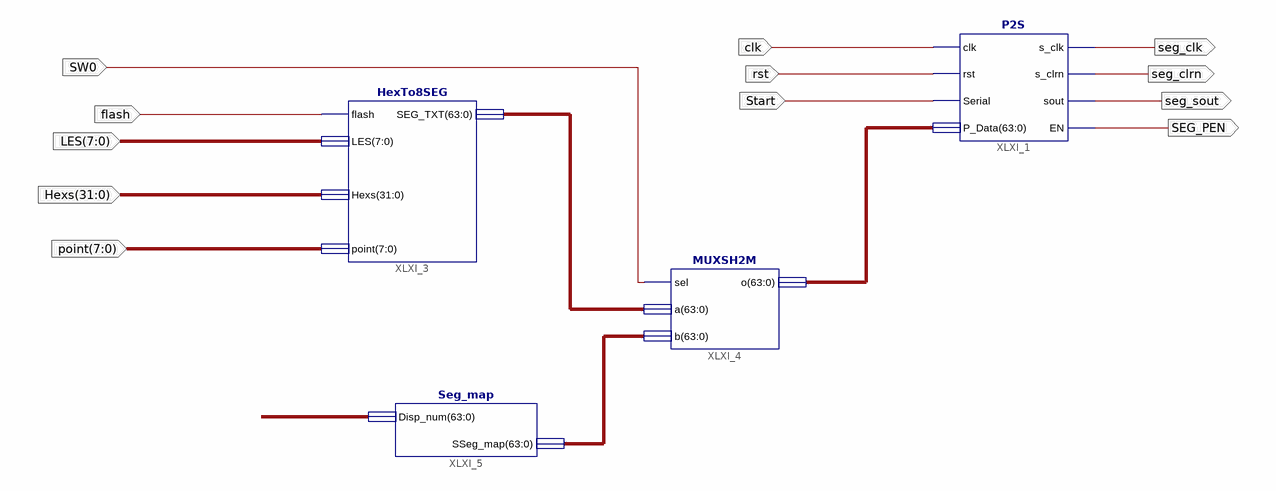
[diagram p0: schematic sheet 1]
// Xilinx ISE schematic SSeg7_Dev.sch (kintex7) as structural Verilog: 4 symbols, 12 ports
module SSeg7_Dev (
  input  [31:0] Hexs,
  input  [7:0] LES,
  input  flash,
  input  SW0,
  input  clk,
  input  rst,
  input  Start,
  input  [7:0] point,
  output seg_clk,
  output seg_clrn,
  output seg_sout,
  output SEG_PEN
);

  wire [63:0] XLXN_1, XLXN_2, XLXN_12;

  P2S XLXI_1 (
    .clk(clk), .rst(rst), .Serial(Start), .P_Data(XLXN_12), .s_clk(seg_clk), .s_clrn(seg_clrn),
    .sout(seg_sout), .EN(SEG_PEN));
  HexTo8SEG XLXI_3 (.flash(flash), .LES(LES), .Hexs(Hexs), .SEG_TXT(XLXN_1), .point(point));
  MUXSH2M XLXI_4 (.sel(SW0), .a(XLXN_1), .b(XLXN_2), .o(XLXN_12));
  Seg_map XLXI_5 (.Disp_num({Hexs, Hexs}), .SSeg_map(XLXN_2));
endmodule
